# EAGLE design schalterbox (EAGLE 5.12)
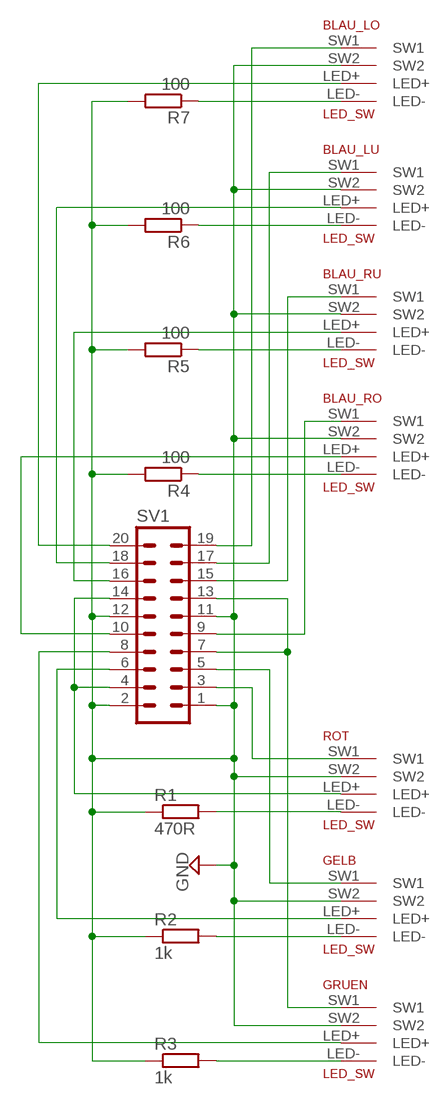
[diagram p0: schematic, sheet 1]

## Parts
BLAU_LO  LED_SW  [LED_SW]
BLAU_LU  LED_SW  [LED_SW]
BLAU_RO  LED_SW  [LED_SW]
BLAU_RU  LED_SW  [LED_SW]
GELB  LED_SW  [LED_SW]
GRUEN  LED_SW  [LED_SW]
R1  470R  R-EU_M0805  [M0805]
R2  1k  R-EU_M0805  [M0805]
R3  1k  R-EU_M0805  [M0805]
R4  100  R-EU_M0805  [M0805]
R5  100  R-EU_M0805  [M0805]
R6  100  R-EU_M0805  [M0805]
R7  100  R-EU_M0805  [M0805]
ROT  LED_SW  [LED_SW]
SV1  ML20L  [ML20L]

## Nets
GND: BLAU_LO.SW2 BLAU_LU.SW2 BLAU_RO.SW2 BLAU_RU.SW2 GELB.SW2 GRUEN.SW2 R1.1 R2.1 R3.1 R4.2 R5.2 R6.2 R7.2 ROT.SW2 SV1.1 SV1.2 SV1.11 SV1.12
N$1: BLAU_RO.LED- R4.1
N$2: ROT.SW1 SV1.3
N$3: ROT.LED+ SV1.4 SV1.14
N$4: GELB.SW1 SV1.5
N$5: GRUEN.SW1 SV1.7 SV1.13
N$6: BLAU_RO.SW1 SV1.9
N$7: GRUEN.LED- R3.2
N$8: GRUEN.LED+ SV1.8
N$9: GELB.LED+ SV1.6
N$10: R1.2 ROT.LED-
N$11: GELB.LED- R2.2
N$12: BLAU_RU.SW1 SV1.15
N$13: BLAU_RU.LED- R5.1
N$14: BLAU_RO.LED+ SV1.10
N$15: BLAU_LU.SW1 SV1.17
N$16: BLAU_LO.SW1 SV1.19
N$17: BLAU_RU.LED+ SV1.16
N$18: BLAU_LU.LED+ SV1.18
N$19: BLAU_LO.LED+ SV1.20
N$20: BLAU_LU.LED- R6.1
N$21: BLAU_LO.LED- R7.1

## Library data of the parts
BLAU_LO BLAU_LU BLAU_RO BLAU_RU GELB GRUEN ROT = ownParts:LED_SW
R1-R7 = resistor:R-EU_: RESISTOR, European symbol
SV1 = con-ml:ML20L: HARTING; OC_FARNELL: unknown; OC_NEWARK: unknown

## Board
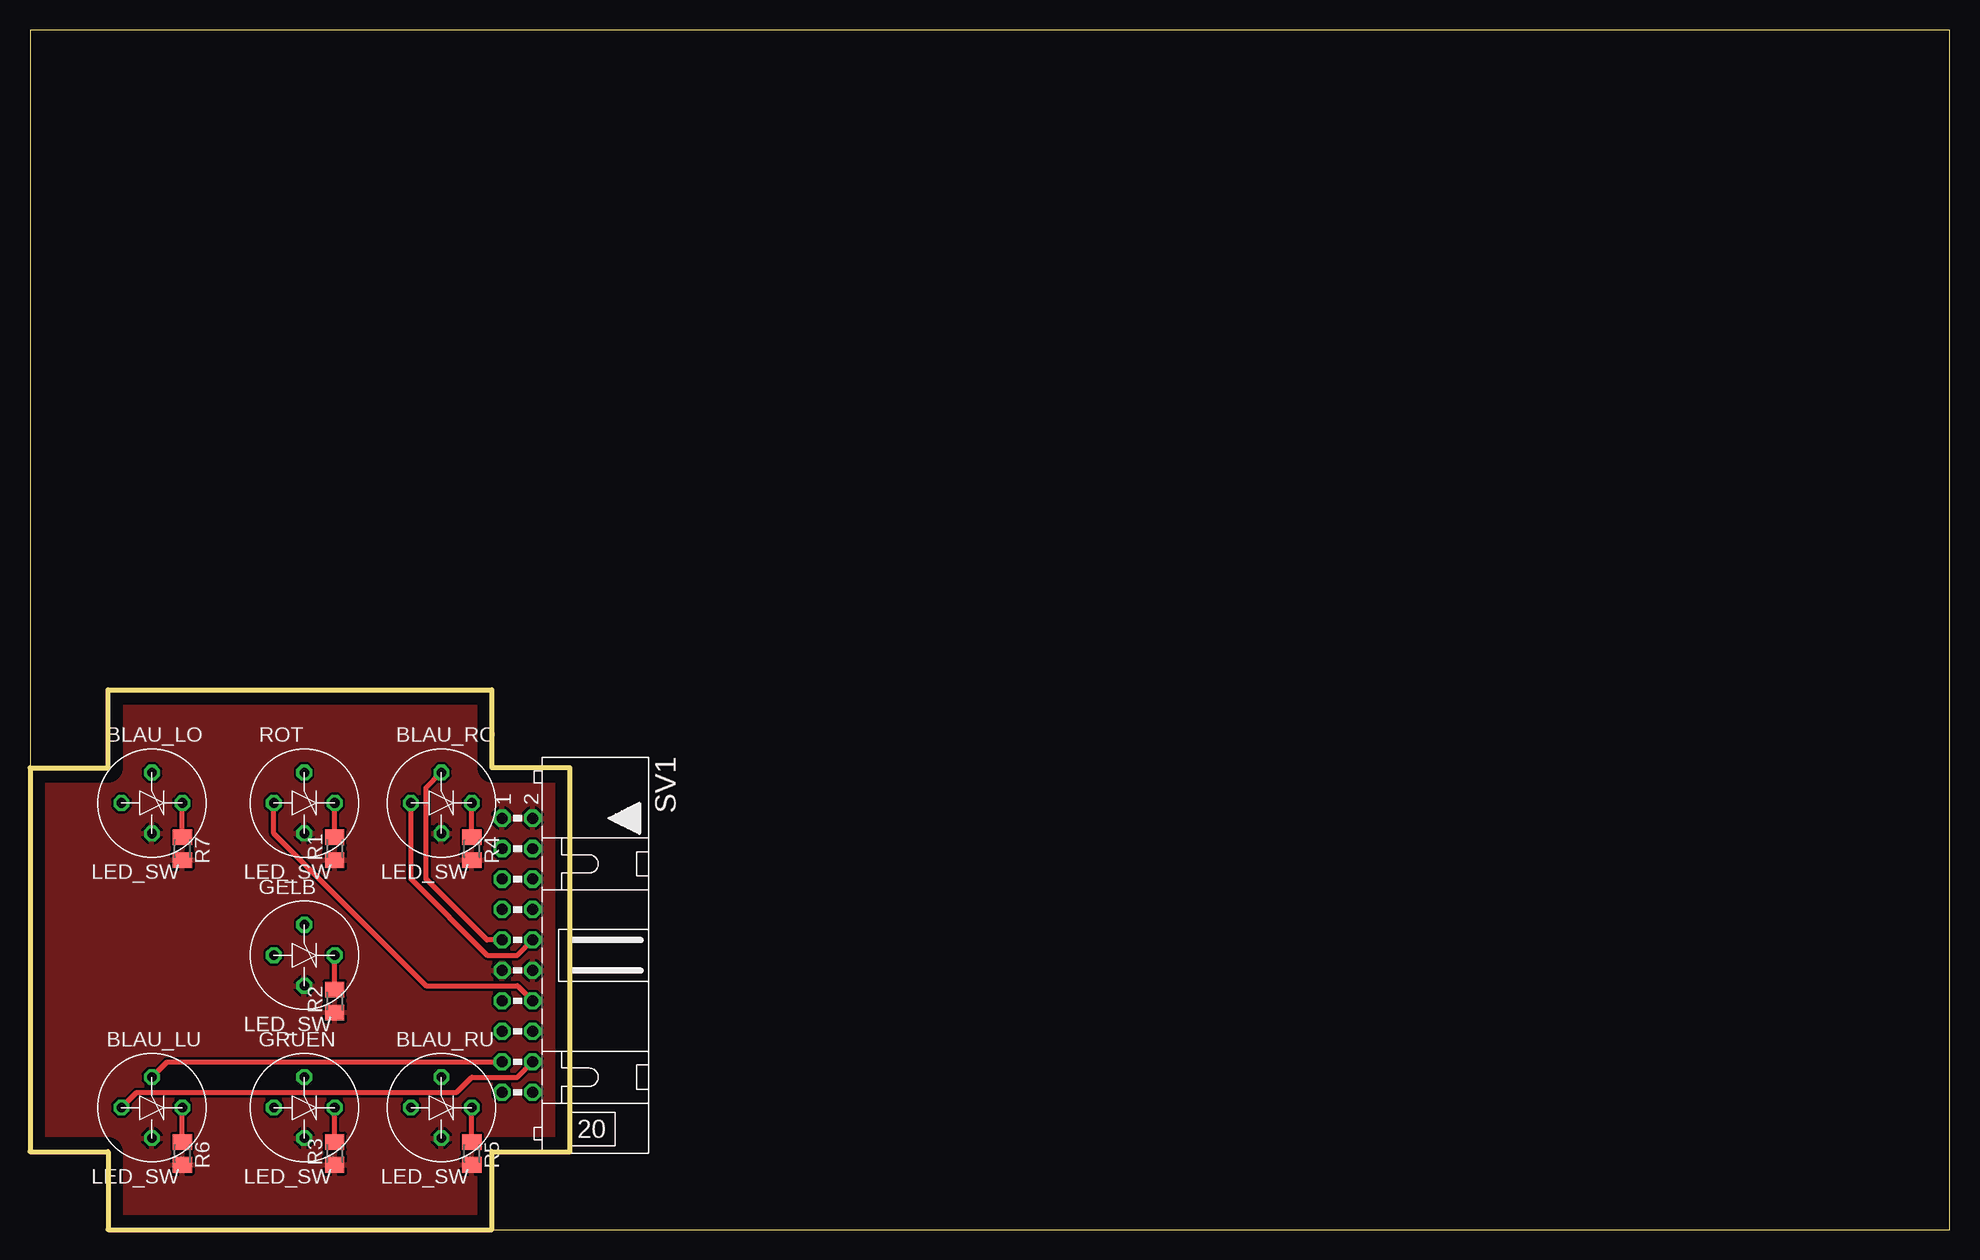
[diagram p1: board, top side]
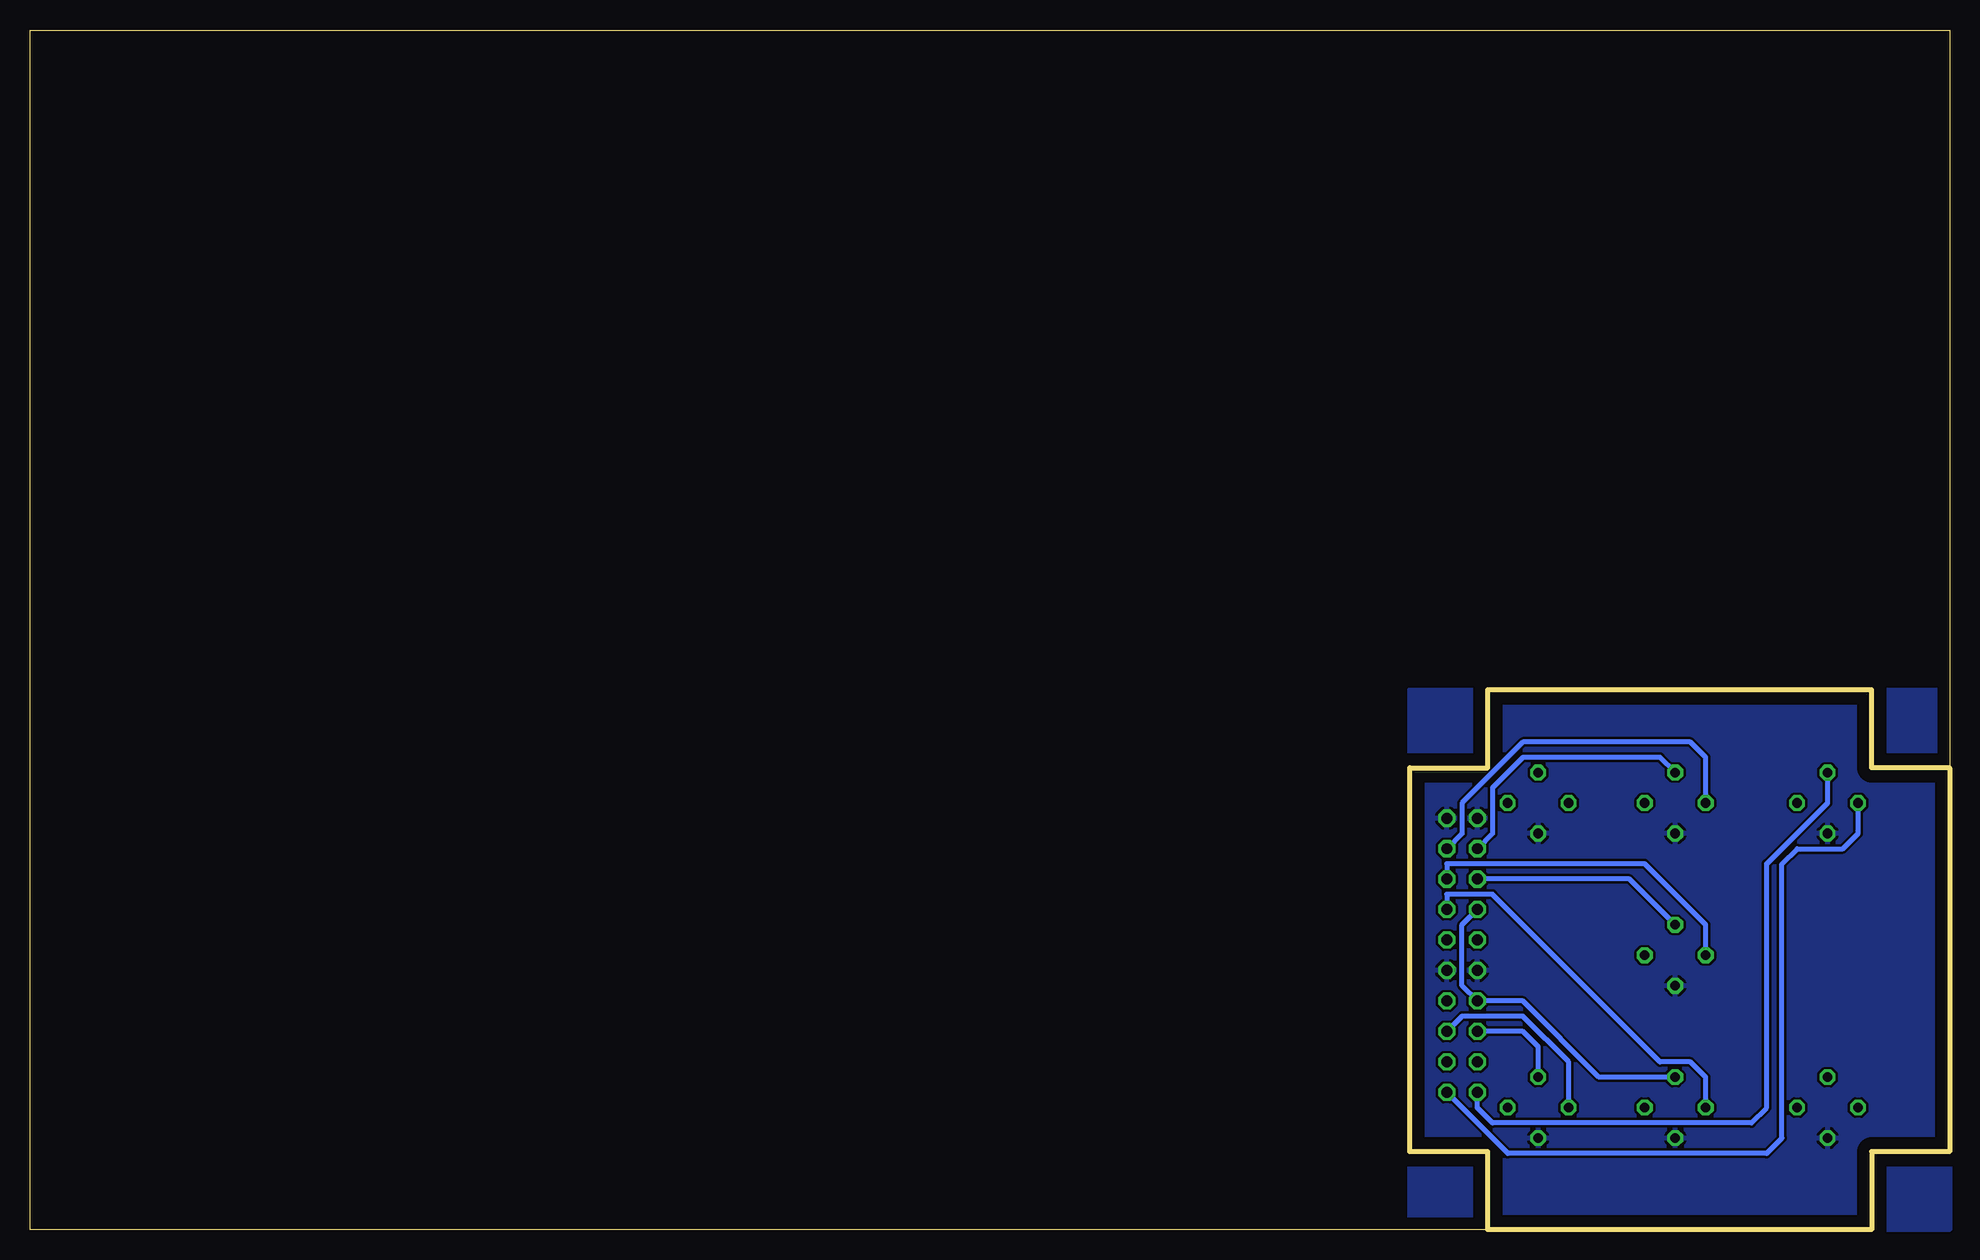
[diagram p2: board, bottom side, seen from below]

Size 160 x 100 mm. Coordinates in mm from the lower left corner, seen from the top.
Outline: 38.5,0 160,0 160,100 0,100 0,38.5
Outline: 0,38.5 0,6.5 6.5,6.5 6.5,0 38.5,0
Outline: 0,38.5 6.5,38.5 6.5,45 38.5,45 38.5,38.5 45,38.5 45,6.5 38.5,6.5 38.5,0
Copper layers (1*16): Top 0.035mm / dielectric 1.5mm / Bottom 0.035mm
Design rules "default": minimum track width 10mil, minimum drill 24mil, track to track 8mil, track to pad 8mil, pad to pad 8mil, via to via 8mil, smd to smd 8mil, copper to edge 40mil, drill to drill 8mil, minimum pad ring 10mil, minimum via ring 8mil, stop-mask expansion 4mil, vias tented up to drill 0mil, thermal gap 10mil

### Footprints (pad centres in the part's own frame; a part is rotated, then mirrored left to right if it is on the bottom)
LED_SW = drill 0.8 octagon: LED+ -2.54,0; LED- 2.54,0; SW1 0,2.54; SW2 0,-2.54
M0805 = smd 1.3 x 1.6: 1 -0.95,0; 2 0.95,0
ML20L = drill 0.914 octagon: 1 -11.43,-1.27; 2 -11.43,1.27; 3 -8.89,-1.27; 4 -8.89,1.27; 5 -6.35,-1.27; 6 -6.35,1.27; 7 -3.81,-1.27; 8 -3.81,1.27; 9 -1.27,-1.27; 10 -1.27,1.27; 11 1.27,-1.27; 12 1.27,1.27; 13 3.81,-1.27; 14 3.81,1.27; 15 6.35,-1.27; 16 6.35,1.27; 17 8.89,-1.27; 18 8.89,1.27; 19 11.43,-1.27; 20 11.43,1.27

### Placement (x,y rotation side)
BLAU_LO  10.16,35.56 0 top
BLAU_LU  10.16,10.16 0 top
BLAU_RO  34.29,35.56 0 top
BLAU_RU  34.29,10.16 0 top
GELB  22.86,22.86 0 top
GRUEN  22.86,10.16 0 top
R1  25.4,31.75 90 top
R2  25.4,19.05 90 top
R3  25.4,6.35 90 top
R4  36.83,31.75 270 top
R5  36.83,6.35 270 top
R6  12.7,6.35 270 top
R7  12.7,31.75 270 top
ROT  22.86,35.56 0 top
SV1  40.64,22.86 270 top

### Tracks (layer width: path | path; a pad name or v marks a point on that pad's centre or on a via)
GND
  pour Bottom: 0,45 0,0 45,0 45,45
  pour Top: 0,45 0,0 45,0 45,45
N$1
  Top 0.406: R4.1 BLAU_RO.LED-
N$2
  Bottom 0.406: SV1.3 38.1,33.02 38.1,36.83 35.56,39.37 24.13,39.37 ROT.SW1
N$3
  Top 0.406: SV1.14 40.64,20.32 33.02,20.32 20.32,33.02 ROT.LED+
  Bottom 0.406: SV1.4 40.64,33.02 40.64,35.56 35.56,40.64 21.59,40.64 20.32,39.37 ROT.LED+
N$4
  Bottom 0.406: SV1.5 26.67,29.21 GELB.SW1
N$5
  Bottom 0.406: GRUEN.SW1 29.21,12.7 35.56,19.05 SV1.13 40.64,20.32 40.64,25.4 SV1.7
N$6
  Top 0.406: SV1.9 38.1,24.13 33.02,29.21 33.02,36.83 BLAU_RO.SW1
N$7
  Top 0.406: R3.2 GRUEN.LED-
N$8
  Bottom 0.406: SV1.8 41.91,27.94 38.1,27.94 24.13,13.97 21.59,13.97 20.32,12.7 GRUEN.LED+
N$9
  Bottom 0.406: SV1.6 41.91,30.48 25.4,30.48 20.32,25.4 GELB.LED+
N$10
  Top 0.406: R1.2 ROT.LED-
N$11
  Top 0.406: R2.2 GELB.LED-
N$12
  Bottom 0.406: SV1.15 35.56,16.51 34.29,15.24 BLAU_RU.SW1
N$13
  Top 0.406: R5.1 BLAU_RU.LED-
N$14
  Top 0.406: SV1.10 40.64,22.86 38.1,22.86 31.75,29.21 BLAU_RO.LED+
N$15
  Top 0.406: SV1.17 11.43,13.97 BLAU_LU.SW1
N$16
  Bottom 0.406: BLAU_LO.SW1 10.16,35.56 15.24,30.48 15.24,10.16 16.51,8.89 38.1,8.89 39.37,10.16 SV1.19
N$17
  Bottom 0.406: SV1.16 40.64,17.78 35.56,17.78 31.75,13.97 BLAU_RU.LED+
N$18
  Top 0.406: SV1.18 40.64,12.7 36.83,12.7 35.56,11.43 8.89,11.43 BLAU_LU.LED+
N$19
  Bottom 0.406: BLAU_LO.LED+ 7.62,33.02 8.89,31.75 12.7,31.75 13.97,30.48 13.97,7.62 15.24,6.35 36.83,6.35 SV1.20
N$20
  Top 0.406: R6.1 BLAU_LU.LED-
N$21
  Top 0.406: R7.1 BLAU_LO.LED-